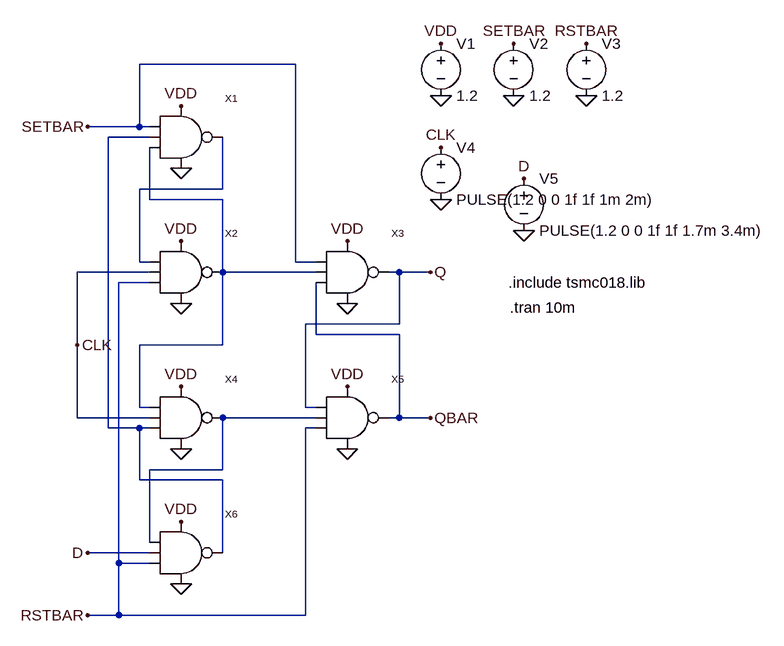
[diagram p0: schematic 3to1NAND DFF tmp.asc]
3to1NAND DFF tmp.asc, the LTspice schematic file:
Version 4
SHEET 1 1180 928
WIRE 368 0 128 0
WIRE 128 96 128 0
WIRE 128 96 48 96
WIRE 144 96 128 96
WIRE 144 112 80 112
WIRE 256 192 256 112
WIRE 256 192 128 192
WIRE 144 208 144 128
WIRE 256 208 144 208
WIRE 128 304 128 192
WIRE 144 304 128 304
WIRE 368 304 368 0
WIRE 400 304 368 304
WIRE 144 320 32 320
WIRE 256 320 256 208
WIRE 400 320 256 320
WIRE 528 320 512 320
WIRE 576 320 528 320
WIRE 144 336 96 336
WIRE 528 400 528 320
WIRE 528 400 384 400
WIRE 400 416 400 336
WIRE 528 416 400 416
WIRE 32 432 32 320
WIRE 256 432 256 320
WIRE 256 432 128 432
WIRE 128 528 128 432
WIRE 144 528 128 528
WIRE 384 528 384 400
WIRE 400 528 384 528
WIRE 32 544 32 432
WIRE 144 544 32 544
WIRE 400 544 256 544
WIRE 528 544 528 416
WIRE 528 544 512 544
WIRE 576 544 528 544
WIRE 80 560 80 112
WIRE 128 560 80 560
WIRE 144 560 128 560
WIRE 400 560 384 560
WIRE 256 624 256 544
WIRE 256 624 144 624
WIRE 128 640 128 560
WIRE 256 640 128 640
WIRE 144 736 144 624
WIRE 144 752 48 752
WIRE 256 752 256 640
WIRE 96 768 96 336
WIRE 144 768 96 768
WIRE 96 848 96 768
WIRE 96 848 48 848
WIRE 384 848 384 560
WIRE 384 848 96 848
FLAG 192 64 VDD
FLAG 192 272 VDD
FLAG 448 272 VDD
FLAG 448 496 VDD
FLAG 192 496 VDD
FLAG 192 704 VDD
FLAG 192 160 0
FLAG 192 368 0
FLAG 448 368 0
FLAG 448 592 0
FLAG 192 592 0
FLAG 192 800 0
FLAG 48 96 SETBAR
FLAG 32 432 CLK
FLAG 48 752 D
FLAG 48 848 RSTBAR
FLAG 576 320 Q
FLAG 576 544 QBAR
FLAG 592 48 0
FLAG 704 48 0
FLAG 816 48 0
FLAG 592 -32 VDD
FLAG 704 -32 SETBAR
FLAG 816 -32 RSTBAR
FLAG 592 208 0
FLAG 720 256 0
FLAG 592 128 CLK
FLAG 720 176 D
SYMBOL 3to1NAND_x1 176 128 R0
SYMATTR InstName X1
SYMBOL 3to1NAND_x1 176 336 R0
SYMATTR InstName X2
SYMBOL 3to1NAND_x1 432 336 R0
SYMATTR InstName X3
SYMBOL 3to1NAND_x1 176 560 R0
SYMATTR InstName X4
SYMBOL 3to1NAND_x1 432 560 R0
SYMATTR InstName X5
SYMBOL 3to1NAND_x1 176 768 R0
SYMATTR InstName X6
SYMBOL voltage 592 -48 R0
WINDOW 123 0 0 Left 0
WINDOW 39 0 0 Left 0
SYMATTR InstName V1
SYMATTR Value 1.2
SYMBOL voltage 704 -48 R0
WINDOW 123 0 0 Left 0
WINDOW 39 0 0 Left 0
SYMATTR InstName V2
SYMATTR Value 1.2
SYMBOL voltage 816 -48 R0
WINDOW 123 0 0 Left 0
WINDOW 39 0 0 Left 0
SYMATTR InstName V3
SYMATTR Value 1.2
SYMBOL voltage 592 112 R0
WINDOW 123 0 0 Left 0
WINDOW 39 0 0 Left 0
SYMATTR InstName V4
SYMATTR Value PULSE(1.2 0 0 1f 1f 1m 2m)
SYMBOL voltage 720 160 R0
WINDOW 123 0 0 Left 0
WINDOW 39 0 0 Left 0
SYMATTR InstName V5
SYMATTR Value PULSE(1.2 0 0 1f 1f 1.7m 3.4m)
TEXT 698 374 Left 2 !.tran 10m
TEXT 696 336 Left 2 !.include tsmc018.lib

The netlist it stands for:
* 3to1NAND DFF tmp.asc
XX1 SETBAR N001 N003 VDD 0 N002 3to1NAND_x1  ; pins A B C VDD VSS OUT
XX2 N002 CLK RSTBAR VDD 0 N003 3to1NAND_x1  ; pins A B C VDD VSS OUT
XX3 SETBAR N003 QBAR VDD 0 Q 3to1NAND_x1  ; pins A B C VDD VSS OUT
XX4 N003 CLK N001 VDD 0 N004 3to1NAND_x1  ; pins A B C VDD VSS OUT
XX5 Q N004 RSTBAR VDD 0 QBAR 3to1NAND_x1  ; pins A B C VDD VSS OUT
XX6 N004 D RSTBAR VDD 0 N001 3to1NAND_x1  ; pins A B C VDD VSS OUT
V1 VDD 0 1.2
V2 SETBAR 0 1.2
V3 RSTBAR 0 1.2
V4 CLK 0 PULSE(1.2 0 0 1f 1f 1m 2m)
V5 D 0 PULSE(1.2 0 0 1f 1f 1.7m 3.4m)
.tran 10m
.include tsmc018.lib
.backanno
.end